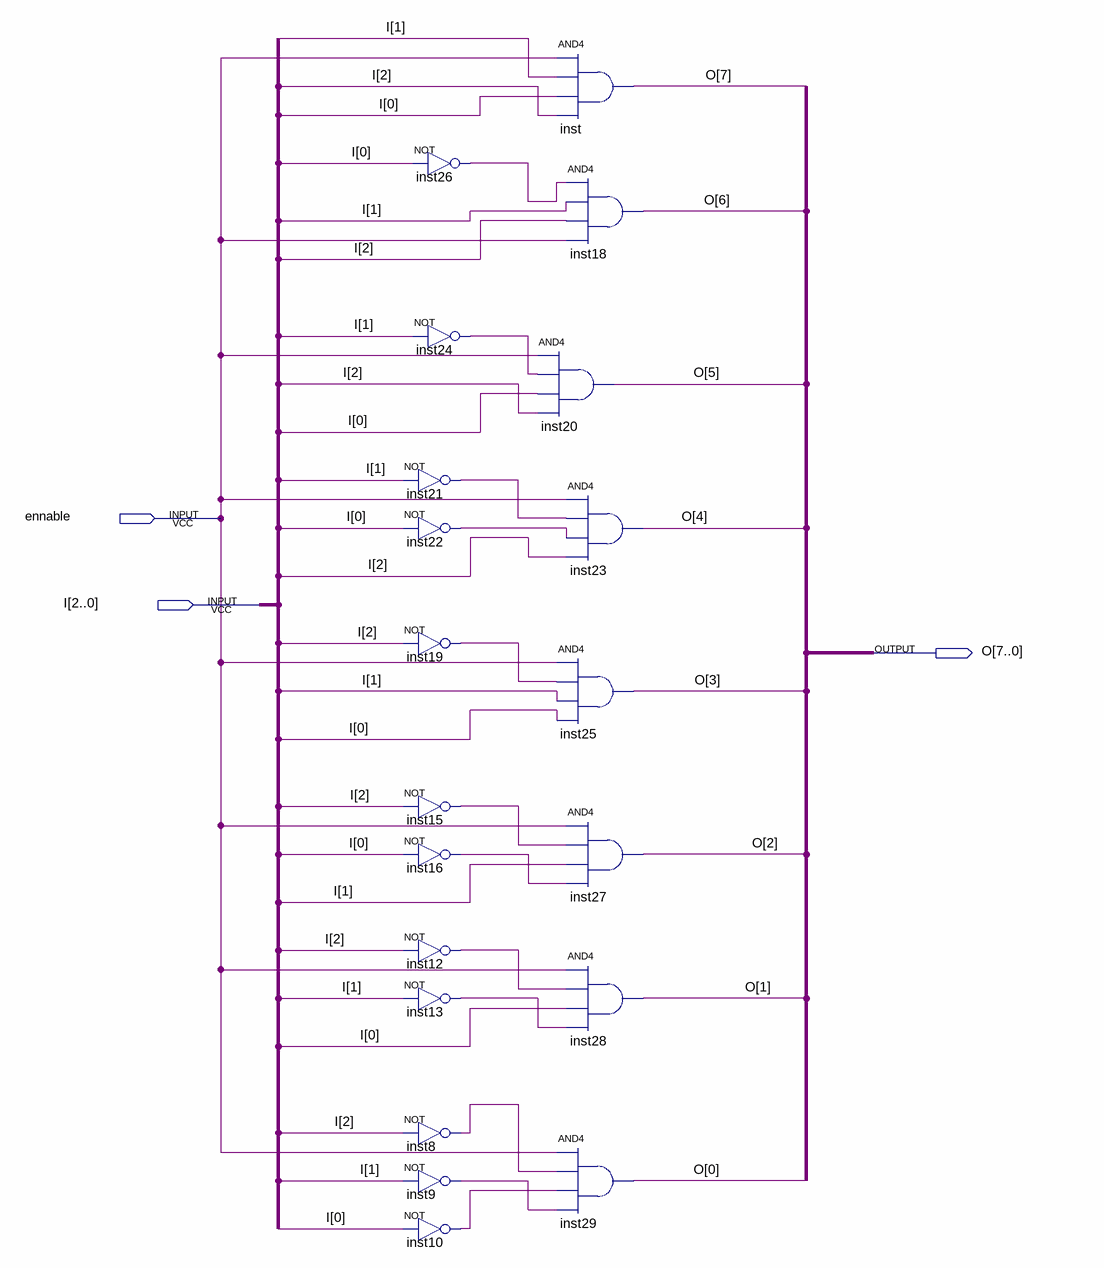
[diagram p0: schematic sheet]
// Quartus schematic decoder3to8.bdf as structural Verilog: 20 symbols, 3 pins
module decoder3to8 (
  input  ennable,
  input  [2:0] I,
  output [7:0] O
);

  wire inst8_out, inst9_out, inst10_out, inst12_out, inst13_out, inst15_out, inst16_out, inst19_out,
       inst21_out, inst22_out, inst24_out, inst26_out;

  not inst26 (inst26_out, I[0]);
  not inst24 (inst24_out, I[1]);
  not inst21 (inst21_out, I[1]);
  not inst22 (inst22_out, I[0]);
  not inst19 (inst19_out, I[2]);
  not inst15 (inst15_out, I[2]);
  not inst16 (inst16_out, I[0]);
  not inst12 (inst12_out, I[2]);
  not inst13 (inst13_out, I[1]);
  not inst8 (inst8_out, I[2]);
  not inst9 (inst9_out, I[1]);
  not inst10 (inst10_out, I[0]);
  and inst (O[7], ennable, I[1], I[0], I[2]);
  and inst18 (O[6], inst26_out, I[1], I[2], ennable);
  and inst20 (O[5], ennable, inst24_out, I[0], I[2]);
  and inst23 (O[4], ennable, inst21_out, inst22_out, I[2]);
  and inst25 (O[3], ennable, inst19_out, I[1], I[0]);
  and inst27 (O[2], ennable, inst15_out, I[1], inst16_out);
  and inst28 (O[1], ennable, inst12_out, I[0], inst13_out);
  and inst29 (O[0], ennable, inst8_out, inst10_out, inst9_out);
endmodule
